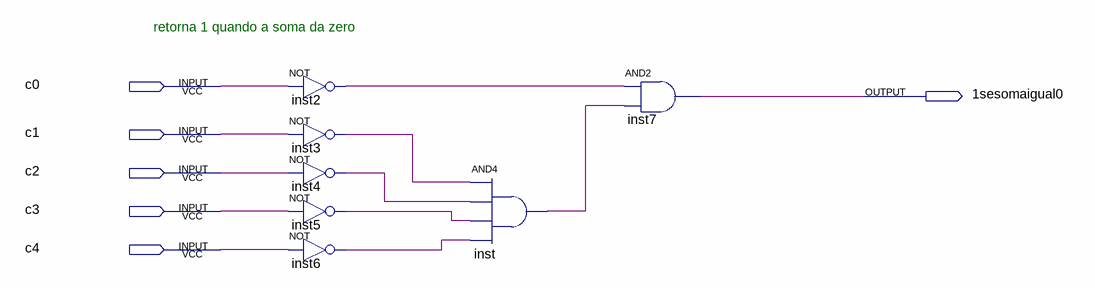
[diagram p0: schematic sheet]
// Quartus schematic retorna1_sesomaigual0.bdf as structural Verilog: 7 symbols, 6 pins
module retorna1_sesomaigual0 (
  input  c0,
  input  c1,
  input  c2,
  input  c3,
  input  c4,
  output \1sesomaigual0 
);

  wire inst2_out, inst3_out, inst4_out, inst5_out, inst6_out, inst_out;

  not inst2 (inst2_out, c0);
  not inst3 (inst3_out, c1);
  not inst4 (inst4_out, c2);
  not inst5 (inst5_out, c3);
  not inst6 (inst6_out, c4);
  and inst (inst_out, inst3_out, inst4_out, inst5_out, inst6_out);
  and inst7 (\1sesomaigual0 , inst2_out, inst_out);

  // Notes on the sheet:
  //   retorna 1 quando a soma da zero
endmodule
